# EAGLE design mount (EAGLE 8.6.0)
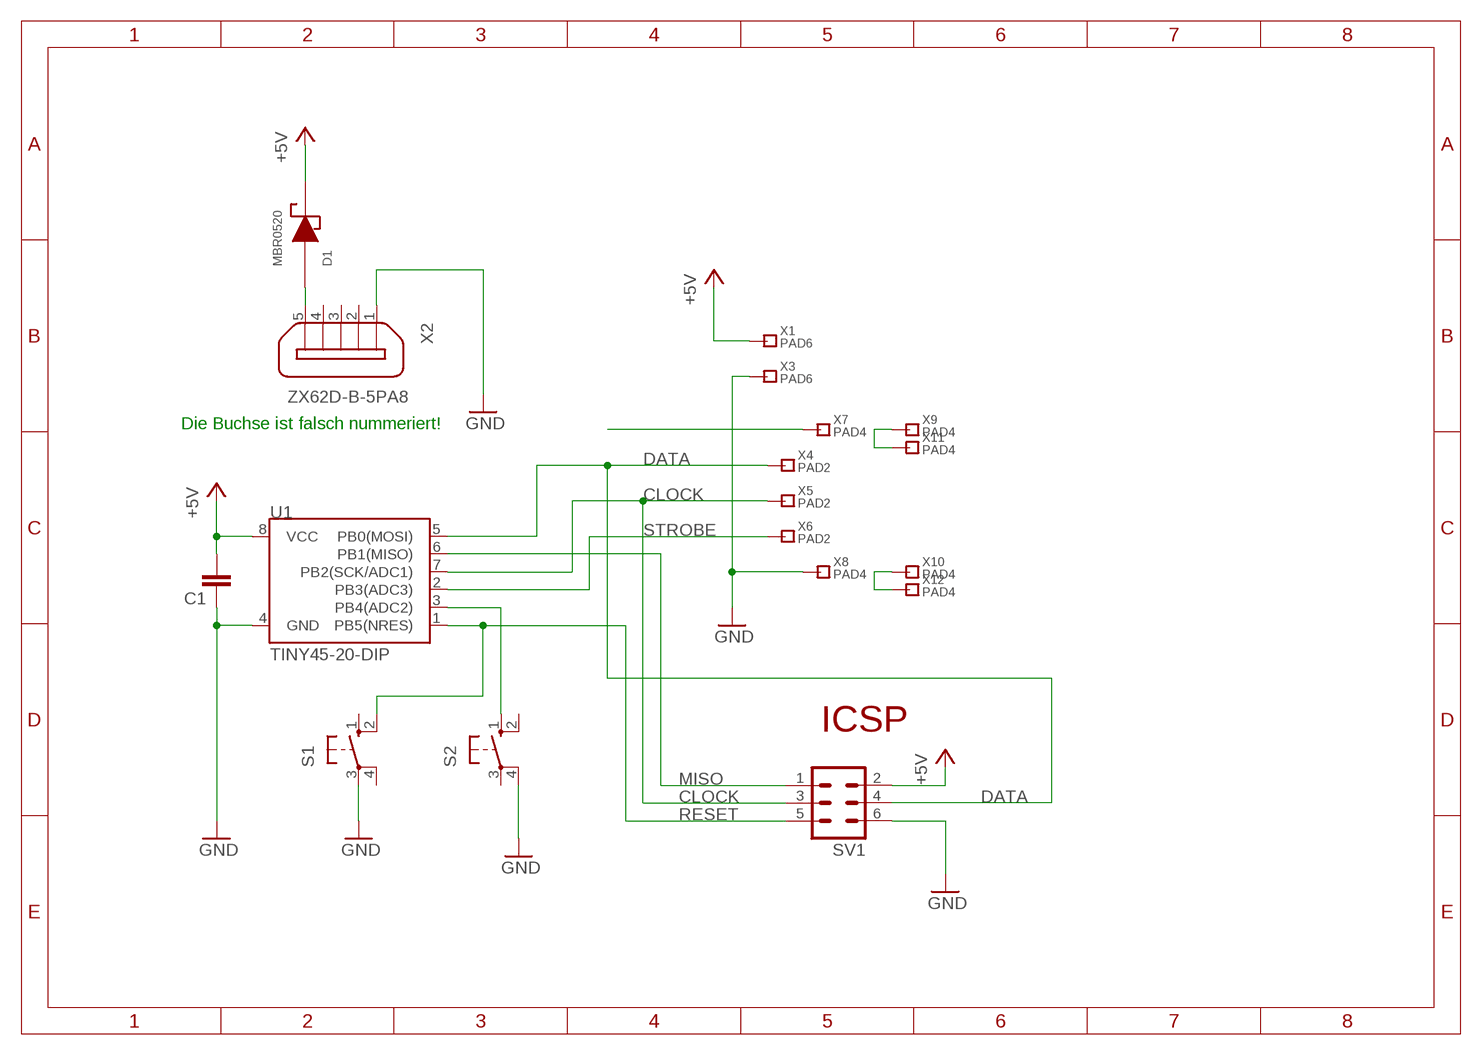
[diagram p0: schematic, sheet 1]

## Parts
C1  C-EUC0805  [C0805]
D1  MBR0520  [SOD-123]
S1  10-XX  [B3F-10XX]
S2  10-XX  [B3F-10XX]
SV1  MA03-2  [MA03-2]
U1  TINY45-20-DIP  ATTINY45TINY45-20-DIP  [DIP08_MCU]
X1  PAD6  [SMDPAD]
X2  ZX62D-B-5PA8  [ZX62D-B-5PA8]
X3  PAD6  [SMDPAD]
X4  PAD2  [SMDPAD_S]
X5  PAD2  [SMDPAD_S]
X6  PAD2  [SMDPAD_S]
X7  PAD4  [SMDPAD_M]
X8  PAD4  [SMDPAD_M]
X9  PAD4  [SMDPAD_M]
X10  PAD4  [SMDPAD_M]
X11  PAD4  [SMDPAD_M]
X12  PAD4  [SMDPAD_M]

## Nets
+5V: C1.2 D1.1(CA) SV1.2 U1.8(VCC) X1.P$1
CLOCK: SV1.3 U1.7(PB2(SCK/ADC1)) X5.P$1
DATA: SV1.4 U1.5(PB0(MOSI)) X4.P$1
GND: C1.1 S1.3(P) S2.4(P1) SV1.6 U1.4(GND) X2.1 X3.P$1 X8.P$1
MISO: SV1.1 U1.6(PB1(MISO))
N$2: X9.P$1 X11.P$1
N$3: X10.P$1 X12.P$1
N$4: S2.1(S) U1.3(PB4(ADC2))
N$5: X7.P$1
N$6: D1.2(AN) X2.5
RESET: S1.2(S1) SV1.5 U1.1(PB5(NRES))
STROBE: U1.2(PB3(ADC3)) X6.P$1
Unconnected: S1.1(S) S1.4(P1) S2.2(S1) S2.3(P) X2.2 X2.3 X2.4 X2.S1 X2.S2 X2.S3 X2.S4

## Notes on the sheet
- Die Buchse ist falsch nummeriert!
- ICSP

## Library data of the parts
C1 = rcl:C-EU: CAPACITOR, European symbol; SPICEPREFIX: C
D1 = MySMD:MBR0520
S1 S2 = switch-omron:10-XX: OMRON SWITCH; MPN: B3F-1000; OC_FARNELL: 176432; OC_NEWARK: 36M3542
SV1 = con-lstb:MA03-2: PIN HEADER; OC_FARNELL: unknown; OC_NEWARK: unknown
U1 = SparkFun-Retired:ATTINY45: Atmel 8-pin 2/4/8kB flash uC Retired; PROD_ID: IC-09439
X1 X3-X12 = Osterparts:PAD
X2 = zx62d-b-5pa8-oshpark_10:ZX62D-B-5PA8: Micro USB Type B Connector - Standard, Shell Through Hole Source: http://www.hirose.co.jp/cataloge_hp/ed_ZX_20140804.pdf; MF: Hirose; MPN: ZX62D-B-5PA8; OC_FARNELL: 2300438; OC_NEWARK: 69W0712

## Board
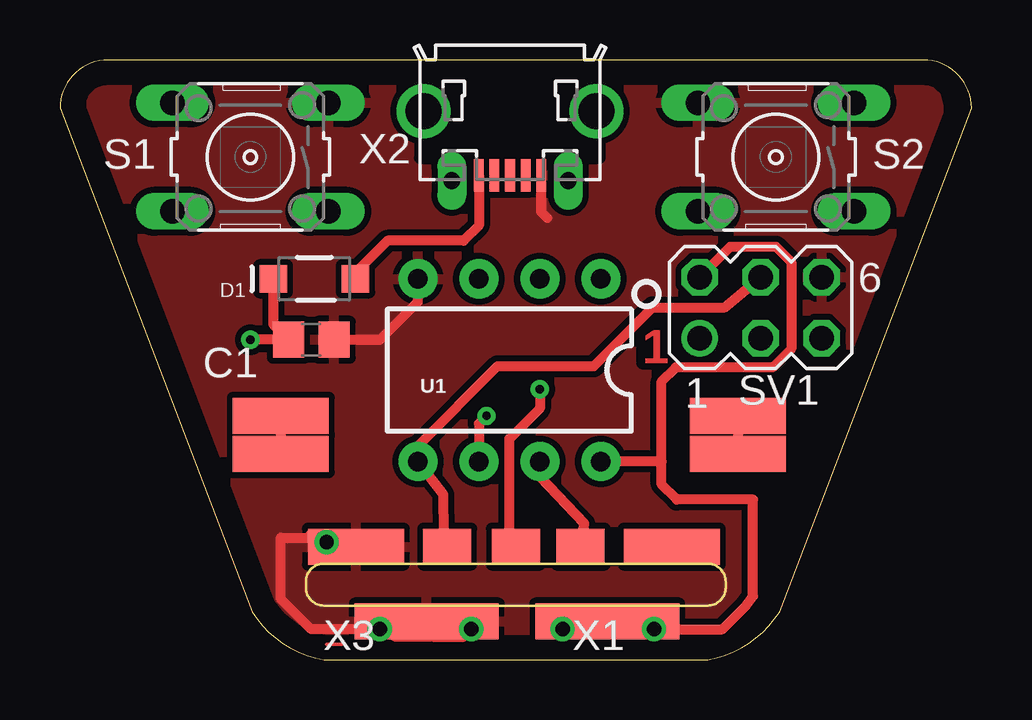
[diagram p1: board, top side]
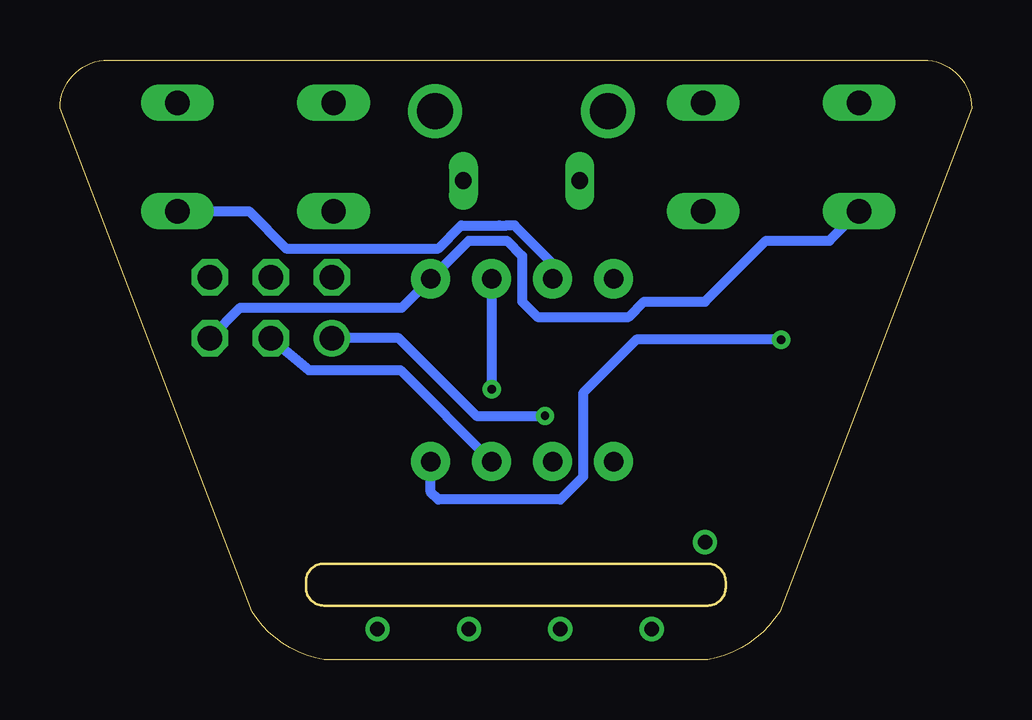
[diagram p2: board, bottom side, seen from below]

Size 38 x 25 mm. Coordinates in mm from the lower left corner, seen from the top.
Outline: 38,23 arc90 36,25 2,25 arc90 0,23 8,2 arc48 11,0 27,0 arc48 30,2 38,23
Copper layers (1*16): Top 0.035mm / dielectric 1.5mm / Bottom 0.035mm
Design rules "default": minimum track width 6mil, minimum drill 0.35mm, track to track 6mil, track to pad 6mil, pad to pad 6mil, via to via 6mil, smd to smd 6mil, copper to edge 40mil, drill to drill 6mil, minimum pad ring 10mil, minimum via ring 8mil, stop-mask expansion 4mil, vias tented up to drill 0mil, thermal gap 10mil
Milling: 8 lines

### Footprints (pad centres in the part's own frame; a part is rotated, then mirrored left to right if it is on the bottom)
C0805 = smd 1.3 x 1.5: 1 -0.95,0; 2 0.95,0
SOD-123 = smd 1.143 x 1.143: 1 0,0; 2 3.429,0
B3F-10XX = drill 1.016 long: 1 -3.251,2.261; 2 3.251,2.261; 3 -3.251,-2.261; 4 3.251,-2.261
MA03-2 = drill 1.016: 1 -2.54,-1.27 | drill 1.016 octagon: 2 -2.54,1.27; 3 0,-1.27; 4 0,1.27; 5 2.54,-1.27; 6 2.54,1.27
DIP08_MCU = drill 0.813 pad 1.626: 1 -3.81,-3.81; 2 -1.27,-3.81; 3 1.27,-3.81; 4 3.81,-3.81; 5 3.81,3.81; 6 1.27,3.81; 7 -1.27,3.81; 8 -3.81,3.81
SMDPAD = smd 6 x 1.5: P$1 0,0
ZX62D-B-5PA8 = smd 1.35 x 0.4: 1 4.825,1.3; 2 4.825,0.65; 3 4.825,0; 4 4.825,-0.65; 5 4.825,-1.3 | drill 1.5: S1 2.15,-3.6; S2 2.15,3.6 | drill 0.7 long: S3 5.05,2.425; S4 5.05,-2.425
SMDPAD_S = smd 2 x 1.5: P$1 0,0
SMDPAD_M = smd 4 x 1.5: P$1 0,0

### Placement (x,y rotation side)
C1  10.48,13.34 180 top
D1  8.89,15.88 0 top
S1  7.94,20.95 180 top
S2  29.84,20.95 180 top
SV1  29.21,14.67 0 top
U1  18.73,12.06 180 top
X1  22.81,1.59 0 top
X2  18.76,25.02 270 top
X3  15.29,1.59 0 top
X4  16.14,4.7 0 top
X5  21.7,4.7 0 top
X6  19,4.7 0 top
X7  25.5,4.7 0 top
X8  12.34,4.7 0 top
X9  9.21,8.57 0 top
X10  28.26,8.57 180 top
X11  9.21,10.16 0 top
X12  28.26,10.16 0 top

### Tracks (layer width: path | path; a pad name or v marks a point on that pad's centre or on a via)
+5V  (via drill 0.35, 0.6)
  Top 0.406: X1.P$1 22.81,1.27 | 23.13,1.27 v24.77,1.27 | X1.P$1 23.13,1.27 | 23.13,1.27 22.81,1.27 | 22.81,1.27 v20.95,1.27 | X1.P$1 25.08,1.59 25.4,1.27 27.62,1.27 28.57,2.22 28.89,2.64 28.89,6.67 25.72,6.67 25.08,7.3 25.08,8.26 | 25.08,8.26 U1.8 | 25.08,8.26 25.08,11.59 25.68,12.18 29.71,12.18 30.48,12.95 30.48,16.58 29.84,17.21 27.94,17.21 SV1.2 | D1.1 8.89,13.97 C1.2 v7.94,13.34
  Bottom 0.406: v7.94,13.34 13.97,13.34 16.19,11.11 16.19,7.62 17.14,6.67 22.23,6.67 22.54,6.99 U1.8
CLOCK
  Top 0.406: X5.P$1 21.86,5.67 20,7.62 U1.7
  Bottom 0.406: SV1.3 27.62,12.06 23.81,12.06 U1.7
DATA
  Top 0.406: X4.P$1 16,4.84 16,5.25 15.98,6.88 U1.5 14.92,8.91 18.25,12.23 22.25,12.23 24.7,14.68 27.7,14.68 SV1.4
GND  (via drill 0.6)
  Top 0.406: X3.P$1 15.29,0.95 | 15.56,0.95 13.97,0.95 v13.34,1.27 | X3.P$1 15.24,1.54 15.56,0.95 | 15.56,0.95 16.83,0.95 v17.14,1.27 | X8.P$1 11.8,4.76 11.11,4.76 v11.11,4.9 | X3.P$1 12.7,1.59 12.38,1.27 10.48,1.27 9.21,2.54 9.21,5.08 10.34,5.08 10.49,5.23 11.11,5.23 | C1.1 13.34,13.34 14.92,14.92 U1.4 | X2.1 20.06,18.68 20.32,18.41
  pour Top (isolate 0.254): 8.57,3.49 0.95,22.54 0.95,23.5 1.59,24.13 35.88,24.13 36.51,23.5 36.83,22.23 29.21,2.54 28.26,1.59 26.99,0.95 11.11,0.95 9.84,1.59 9.21,2.22
MISO  (via drill 0.35)
  Top 0.406: v17.78,10.16 17.46,9.84 U1.6
  Bottom 0.406: v17.78,10.16 20.64,10.16 23.88,13.4 SV1.1
N$1
  Top 0.152: 11.75,0.64 11.11,0.64
N$2
  Top 0.406: X11.P$1 X9.P$1
N$3
  Top 0.406: X12.P$1 X10.P$1
N$4
  Bottom 0.406: S2.1 30.12,18.69 28.57,17.14 22.23,17.14 21.27,18.1 19.68,18.1 19.37,18.1 19.05,18.1 17.46,16.51 U1.3
N$6
  Top 0.406: X2.5 17.46,18.09 16.83,17.46 13.65,17.46 12.32,16.13 D1.2
RESET
  Bottom 0.406: SV1.5 30.48,14.67 23.75,14.67 U1.1 20.95,17.46 19.37,17.46 18.73,16.83 18.73,14.92 18.1,14.29 14.29,14.29 13.65,14.92 11.11,14.92 8.57,17.46 5.92,17.46 S1.2
STROBE  (via drill 0.35)
  Top 0.406: X6.P$1 18.73,5.45 18.73,9.21 20,10.48 v20,11.27
  Bottom 0.406: U1.2 v20,11.27

### Text on the board
Top: 1
tStop: 1